# Altium schematic sheet BLE Module.SchDoc: BLE Module
size 431 x 279 mm; DrawnBy: Teddie Vidolova; Organization: Synapse Product Development, LLC.; Address1: 1511 6th Ave., Suite 400; Address2: Seattle, Washington 98101; Address3: 206.381.0898; Address4: www.synapse.com; PageSetup: Record=PageOptions|CenterHorizontal=True|CenterVertical=True|PrintScale=1.06|XCorrection=1.00|YCorrection=1.00|PrintKind=1|BorderSize=5000000|LeftOffset=0|BottomOffset=0|Orientation=2|PaperLength=4318|PaperWidth=2794|Scale=100|PaperSource=7|PrintQuality=200|MediaType=1|DitherType=10|PrintScaleMode=1|PaperKind=11x17|PaperIndex=3
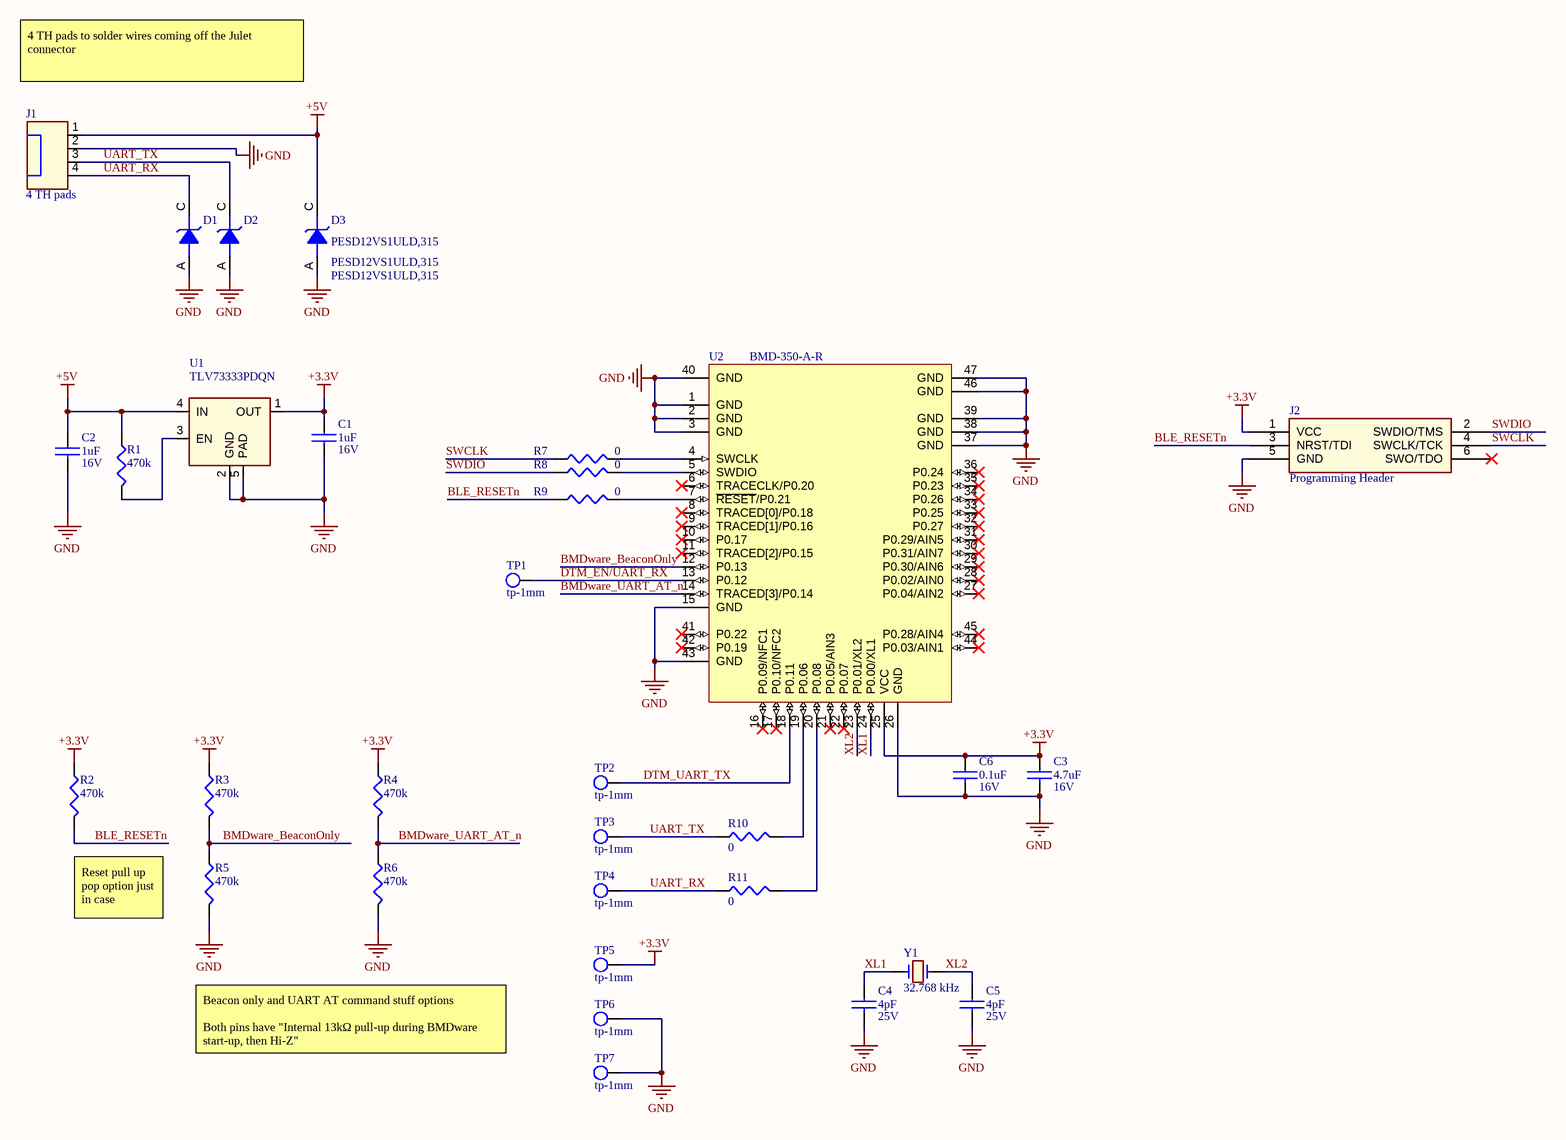
[diagram p0: BLE Module.SchDoc]

## Parts
C1  1uF  Voltage: 16V  [0603-ipcsm_90]
C2  1uF  Voltage: 16V  [0603-ipcsm_90]
C3  4.7uF  Voltage: 16V  [0603-ipcsm_90]
C4  4pF  Voltage: 25V  [0201-ipcsm_33]
C5  4pF  Voltage: 25V  [0201-ipcsm_33]
C6  0.1uF  Voltage: 16V  [0402-ipcsm_55]
D1  PESD12VS1ULD,315  [SOD882D]
D2  PESD12VS1ULD,315  [SOD882D]
D3  PESD12VS1ULD,315  [SOD882D]
J1  4 TH pads  [HEADER_1X4]
J2  Programming Header  [TC2030-MCP]
R1  470k  [0402-ipcsm_40]
R2  470k  [0402-ipcsm_40]
R3  470k  [0402-ipcsm_40]
R4  470k  [0402-ipcsm_40]
R5  470k  [0402-ipcsm_40]
R6  470k  [0402-ipcsm_40]
R7  0  [0402-ipcsm_40]
R8  0  [0402-ipcsm_40]
R9  0  [0402-ipcsm_40]
R10  0  [0402-ipcsm_40]
R11  0  [0402-ipcsm_40]
TP1  tp-1mm  [tp-1mm]  (no BOM)
TP2  tp-1mm  [tp-1mm]  (no BOM)
TP3  tp-1mm  [tp-1mm]  (no BOM)
TP4  tp-1mm  [tp-1mm]  (no BOM)
TP5  tp-1mm  [tp-1mm]  (no BOM)
TP6  tp-1mm  [tp-1mm]  (no BOM)
TP7  tp-1mm  [tp-1mm]  (no BOM)
U1  TLV73333PDQN  [son4_tlv707dqn]
U2  BMD-350-A-R  [BMD-350]
Y1  32.768 kHz  [xtal_ABS07-120]

## Nets
+3.3V: C1.1 C3.1 C6.1 J2.1(VCC) R2.1 R3.1 R4.1 TP5.1(TP) U1.1(OUT) U2.25(VCC)
+5V: C2.1 D3.C J1.1 R1.1 U1.4(IN)
GND: C1.2 C2.2 C3.2 C4.2 C5.2 C6.2 D1.A D2.A D3.A J1.2 J2.5(GND) R5.2 R6.2 TP6.1(TP) TP7.1(TP) U1.2(GND) U1.5(PAD) U2.1(GND) U2.2(GND) U2.3(GND) U2.15(GND) U2.26(GND) U2.37(GND) U2.38(GND) U2.39(GND) U2.40(GND) U2.43(GND) U2.46(GND) U2.47(GND)
BLE_RESETn: J2.3(NRST/TDI) R2.2 R9.1
BMDware_BeaconOnly: R3.2 R5.1 U2.12(P0.13)
BMDware_UART_AT_n: R4.2 R6.1 U2.14(TRACED[3]/P0.14)
DTM_EN/UART_RX: TP1.1(TP) U2.13(P0.12)
DTM_UART_TX: TP2.1(TP) U2.18(P0.11)
SWCLK: J2.4(SWCLK/TCK) R7.1
SWDIO: J2.2(SWDIO/TMS) R8.1
UART_RX: D1.C J1.4 R11.1 TP4.1(TP)
UART_TX: D2.C J1.3 R10.1 TP3.1(TP)
XL1: C4.1 U2.24(P0.00/XL1) Y1.1
XL2: C5.1 U2.23(P0.01/XL2) Y1.2
NetR1_2: R1.2 U1.3(EN)
NetR7_2: R7.2 U2.4(SWCLK)
NetR8_2: R8.2 U2.5(SWDIO)
NetR9_2: R9.2 U2.7(~{RESET}/P0.21)
NetR10_2: R10.2 U2.19(P0.06)
NetR11_2: R11.2 U2.20(P0.08)

Not connected (* = marked no-connect by the designer): J2 6(SWO/TDO)*; U2 6(TRACECLK/P0.20)* 8(TRACED[0]/P0.18)* 9(TRACED[1]/P0.16)* 10(P0.17)* 11(TRACED[2]/P0.15)* 16(P0.09/NFC1)* 17(P0.10/NFC2)* 21(P0.05/AIN3)* 22(P0.07)* 27(P0.04/AIN2)* 28(P0.02/AIN0)* 29(P0.30/AIN6)* 30(P0.31/AIN7)* 31(P0.29/AIN5)* 32(P0.27)* 33(P0.25)* 34(P0.26)* 35(P0.23)* 36(P0.24)* 41(P0.22)* 42(P0.19)* 44(P0.03/AIN1)* 45(P0.28/AIN4)*

## Notes on the sheet
- 4 TH pads to solder wires coming off the Julet connector
- Reset pull up pop option just in case
- Beacon only and UART AT command stuff options
  Both pins have "Internal 13kΩ pull-up during BMDware start-up, then Hi-Z"
- Design Notes:
- Layout Notes:
- Project:
- Sheet Title:
- PCBA:
- PROPRIETARY AND CONFIDENTIAL
- Drawn by:
- Schematic Part Number:
- Schematic Revision:
- Date:
- Sheet:
- /

## Library data of the parts
C1 C2 = CL10B105MO8NNWC: CAP CER 1UF 16V X7R 0603; Part_Type: capacitor; TableName: avCapacitors; syn_pn: 610-003669; mfg: Samsung; dist: Digikey; dist_pn: 1276-6524-1-ND; Tolerance: 20%; mfg_pn: CL10B105MO8NNWC; Height: 0.9mm; Status: NS; Dielectric: X7R
C3 = GRM188R61C475KAAJD: CAP CER 4.7UF 16V X5R 0603; Part_Type: capacitor; TableName: avCapacitors; syn_pn: 610-003943; mfg: Murata; dist: Digikey; dist_pn: 490-10481-1-ND; Tolerance: 10%; mfg_pn: GRM188R61C475KAAJD; Height: 0.95mm; Status: NS; Dielectric: X5R
C4 C5 = GRM0335C1H4R0BA01D: CAP CER 4PF 50V C0G/NP0 0201; Part_Type: capacitor; TableName: avCapacitors; syn_pn: 610-008218; mfg: Murata; dist: Digikey; dist_pn: 490-12684-2-ND; Tolerance: 2.5%; Dielectric: C0G-NPO; mfg_pn: GRM0335C1H4R0BA01D; Height: 0.33mm; Status: NS
C6 = GRM155R71C104KA88D: CAP CER .1UF 16V X7R 0402; Part_Type: capacitor; TableName: avCapacitors; syn_pn: 610-003626; mfg: Murata; dist: Digikey; dist_pn: 490-3261-1-ND; Tolerance: 10%; mfg_pn: GRM155R71C104KA88D; Height: 0.55mm; Status: NS; Dielectric: X7R
D1-D3 = PESD12VS1ULD,315: TVS DIODE 12V 35V 2DFN1006D; Part_Type: esd-tvs; TableName: avComponents; syn_pn: 610-008225; mfg: Nexperia USA Inc.; dist: Digikey; dist_pn: 1727-1303-1-ND; mfg_pn: PESD12VS1ULD,315; Height: 0.4mm; Status: CUR
J1 = HEADER 4: 55 mm ZEBRA STRIP; Part_Type: connector; TableName: avLayouts; syn_pn: 610-008220
J2 = FOOTPRINT_TC2030-MCP: FOOTPRINT for CBL PLUG-OF-NAILS 6-PIN WITH CLIP; Part_Type: layout; TableName: avLayouts; syn_pn: 610-007685; mfg_pn: FOOTPRINT_TC2030-MCP
R1-R6 = ERJ-2RKF4703X: RES 470K OHM 1/16W 1% 0402 SMD; Part_Type: resistor; TableName: avResistors; syn_pn: 610-006329; mfg: Panasonic; dist: Digikey; dist_pn: P470KLCT-ND; Power: 0.0625W; mfg_pn: ERJ-2RKF4703X; Height: 0.4mm; Status: NS; Tolerance: 1%
R7-R11 = ERJ-2GE0R00X: RES 0.0 OHM 1/10W JUMP 0402 SMD; Part_Type: resistor; TableName: avResistors; syn_pn: 610-006042; mfg: Panasonic; dist: Digikey; dist_pn: P0.0JCT-ND; Tolerance: 0%; Power: 0.1W; mfg_pn: ERJ-2GE0R00X; Height: 0.4mm; Status: NS
TP1-TP7 = TP_SMT_RD_1mm: TESTPOINT, 1MM SMD; Part_Type: test-point; TableName: avLayouts; syn_pn: 610-007841; mfg_pn: TP_SMT_RD_1mm
U1 = TLV73333PDQNR: IC REG LINEAR 3.3V 300MA 4X2SON; TableName: avComponents; syn_pn: 610-002632; mfg: Texas Instruments; dist: Digikey; dist_pn: 296-40674-1-ND; mfg_pn: TLV73333PDQNR; Part_Type: ic; Height: 0.4mm; Status: NS
U2 = BMD-350-A-R: MOD BLE 4.2 NORDIC NRF52832 SOC; Manufacturer: Rigado; Part_Type: rf-ic; Added By: Cam N; Internal Antenna: Ceramic Chip; Protocol: BLE 4.2; RF Freq: 2.4GHz; TableName: avComponents; syn_pn: 610-008217; mfg: Rigado, Inc.; dist: Digikey; dist_pn: 1604-1012-1-ND; Added Date: 8/9/2016; Height: 1.35mm; Manufacturer P/N: BMD-350-A-R; Size: 8.65mm x 6.4mm; Part Number: BMD-350-A; mfg_pn: BMD-350-A-R; Status: CUR
Y1 = ABS07-120-32.768KHZ-T: CRYSTAL 32.768KHZ 6PF SMD; TableName: avComponents; syn_pn: 610-003300; mfg: Abracon; dist: Digikey; dist_pn: 535-11937-1-ND; mfg_pn: ABS07-120-32.768KHZ-T; Part_Type: crystal; Height: 0.9mm; Status: NS